# EAGLE design Random Bit Module (EAGLE 6.3)
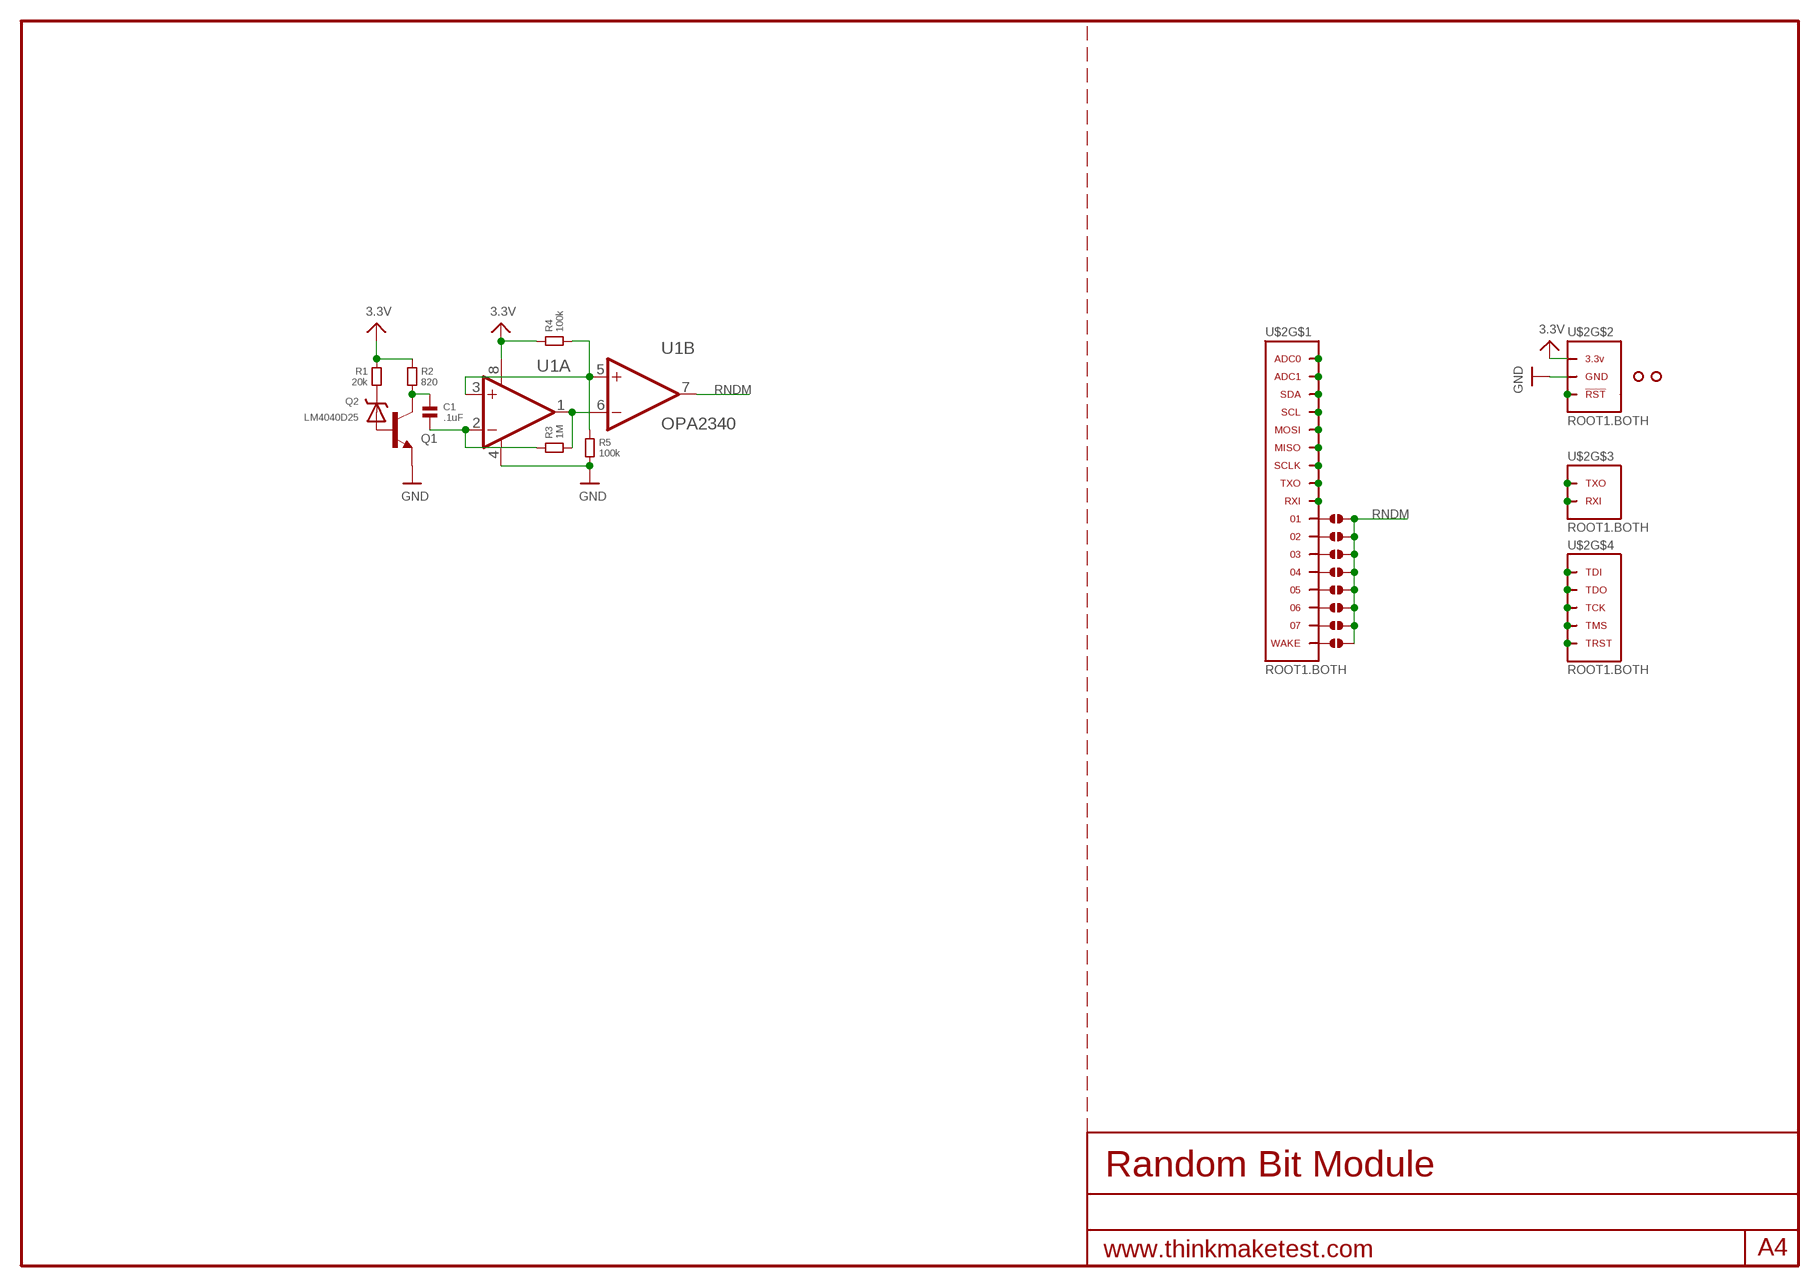
[diagram p0: schematic, sheet 1]

## Parts
C1  .1uF  CAPACITOR.0603  [0603]
J1  SOLDERJUMPER.2.SML  [2.SML]
J2  SOLDERJUMPER.2.SML  [2.SML]
J3  SOLDERJUMPER.2.SML  [2.SML]
J4  SOLDERJUMPER.2.SML  [2.SML]
J5  SOLDERJUMPER.2.SML  [2.SML]
J6  SOLDERJUMPER.2.SML  [2.SML]
J7  SOLDERJUMPER.2.SML  [2.SML]
J8  SOLDERJUMPER.2.SML  [2.SML]
Q1  TRANSISTOR_NPN  [SOT23-R]
Q2  LM4040D25  V-REFERENCESMD  [SOT23-3]
R1  20k  RESISTOR.0603  [0603]
R2  820  RESISTOR.0603  [0603]
R3  1M  RESISTOR.0603  [0603]
R4  100k  RESISTOR.0603  [0603]
R5  100k  RESISTOR.0603  [0603]
U1  OPA2340  OPA2340E  [MSOP08]
U$2  ROOT1.BOTH  [ROOT1.BOTH]
U$3  HOLE.2MM  [2MM]
U$4  HOLE.2MM  [2MM]

## Nets
3.3V: R1.1 R2.1 R4.1 U1.8(A:V+) U$2.3.3V@1(3.3V) U$2.3.3V@2(3.3V) U$2.3.3V@3(3.3V) U$2.3.3V@4(3.3V) U$2.3.3V@5(3.3V) U$2.3.3V@6(3.3V) U$2.3.3V@7(3.3V) U$2.3.3V@8(3.3V) U$2.3.3V@9(3.3V) U$2.3.3V@10(3.3V) U$2.3.3V@11(3.3V) U$2.3.3V@12(3.3V) U$2.3.3V@13(3.3V) U$2.3.3V@14(3.3V) U$2.3.3V@15(3.3V) U$2.3.3V@16(3.3V) U$2.3.3V@17(3.3V) U$2.3.3V@18(3.3V) U$2.3.3V@19(3.3V) U$2.3.3V@20(3.3V) U$2.3.3V@21(3.3V) U$2.3.3V@22(3.3V) U$2.3.3V@23(3.3V) U$2.3.3V@24(3.3V) U$2.3.3V@VIA(3.3V)
GND: Q1.2(E) R5.2 U1.4(A:V-) U$2.GND@1(GND) U$2.GND@2(GND) U$2.GND@3(GND) U$2.GND@4(GND) U$2.GND@5(GND) U$2.GND@6(GND) U$2.GND@7(GND) U$2.GND@8(GND) U$2.GND@9(GND) U$2.GND@10(GND) U$2.GND@11(GND) U$2.GND@12(GND) U$2.GND@13(GND) U$2.GND@14(GND) U$2.GND@15(GND) U$2.GND@16(GND) U$2.GND@17(GND) U$2.GND@18(GND) U$2.GND@19(GND) U$2.GND@20(GND) U$2.GND@21(GND) U$2.GND@22(GND) U$2.GND@23(GND) U$2.GND@24(GND) U$2.GND@25(GND) U$2.GND@26(GND) U$2.GND@VIA(GND)
N$1: J1.1 U$2.01 U$2.01@1 U$2.01@VIA
N$2: U$2.ADC1 U$2.ADC1@1(ADC1) U$2.ADC1@VIA(ADC1)
N$3: U$2.SDA U$2.SDA@1(SDA) U$2.SDA@VIA(SDA)
N$4: U$2.SCL U$2.SCL@1(SCL) U$2.SCL@VIA(SCL)
N$5: J2.1 U$2.02 U$2.02@1 U$2.02@VIA
N$6: U$2.MISO U$2.MISO@1(MISO) U$2.MISO@VIA(MISO)
N$7: U$2.SCLK U$2.SCLK@1(SCLK) U$2.SCLK@VIA(SCLK)
N$8: U$2.TXO U$2.TXO@1(TXO) U$2.TXO@VIA(TXO)
N$9: U$2.RXI U$2.RXI@1(RXI) U$2.RXI@VIA(RXI)
N$10: J3.1 U$2.03 U$2.03@1 U$2.03@VIA
N$11: J4.1 U$2.04 U$2.04@1 U$2.04@VIA
N$12: U$2.MOSI U$2.MOSI@1(MOSI) U$2.MOSI@VIA(MOSI)
N$13: U$2.ADC0 U$2.ADC0@1(ADC0) U$2.ADC0@VIA(ADC0)
N$14: J5.1 U$2.05 U$2.05@1 U$2.05@VIA
N$15: J6.1 U$2.06 U$2.06@1 U$2.06@VIA
N$16: J7.1 U$2.07 U$2.07@1 U$2.07@VIA
N$17: J8.1 U$2.WAKE U$2.WAKE@1(WAKE) U$2.WAKE@VIA(WAKE)
N$18: U$2.TDI U$2.TDI@1(TDI) U$2.TDI@VIA(TDI)
N$19: U$2.TDO U$2.TDO@1(TDO) U$2.TDO@VIA(TDO)
N$20: U$2.TCK U$2.TCK@1(TCK) U$2.TCK@VIA(TCK)
N$21: U$2.TMS U$2.TMS@1(TMS) U$2.TMS@VIA(TMS)
N$22: U$2.TRST U$2.TRST@1(TRST) U$2.TRST@VIA(TRST)
N$23: U$2.RXI.DBG(RXI) U$2.RXI.DBG@1(RXI) U$2.RXI.DBG@VIA(RXI)
N$24: U$2.TXO.DBG(TXO) U$2.TXO.DBG@1(TXO) U$2.TXO.DBG@VIA(TXO)
N$25: U$2.RST(!RST) U$2.RST@1(!RST) U$2.RST@VIA(!RST)
N$33: Q2.1(C) R1.2
N$34: C1.1 Q1.3(C) R2.2
N$35: Q1.1(B) Q2.2(A)
N$36: C1.2 R3.1 U1.2(A:-IN)
N$37: R4.2 R5.1 U1.3(A:+IN) U1.5(B:+IN)
N$39: R3.2 U1.1(A:OUT) U1.6(B:-IN)
RNDM: J1.2 J2.2 J3.2 J4.2 J5.2 J6.2 J7.2 J8.2 U1.7(B:OUT)

## Library data of the parts
C1 = .standardparts:CAPACITOR
J1-J8 = .solderjumper:SOLDERJUMPER.2
Q1 = microbuilder:TRANSISTOR_NPN: NPN Transistor Transistor (NPN) 500mA 45V - BC817 [Digikey: 568-1631-1-ND] Transistor (NPN) 500mA 45V - BC817,215 [Mouser: 771-BC817-T/R] SOT23-R - SOT23 footprint optimised for use with solder paste and reflow ovens. SOT23-W - SOT23 footprint optimised for hand-soldering (larger pads).
Q2 = SparkFun-DiscreteSemi:V-REFERENCE: Zener diode
R1-R5 = .standardparts:RESISTOR
U1 = burr-brown:OPA2340: Single-Supply, Rail-to-Rail Operational Amplifiers MicroAmplifier(TM) Series; Product Folder:OPA2340; MF: TEXAS INSTRUMENTS; MPN: OPA2340UA; OC_FARNELL: 1101541; OC_NEWARK: 36K7581
U$2 = thinkmaketest:ROOT1
U$3 U$4 = .screw_holes:HOLE

## Board
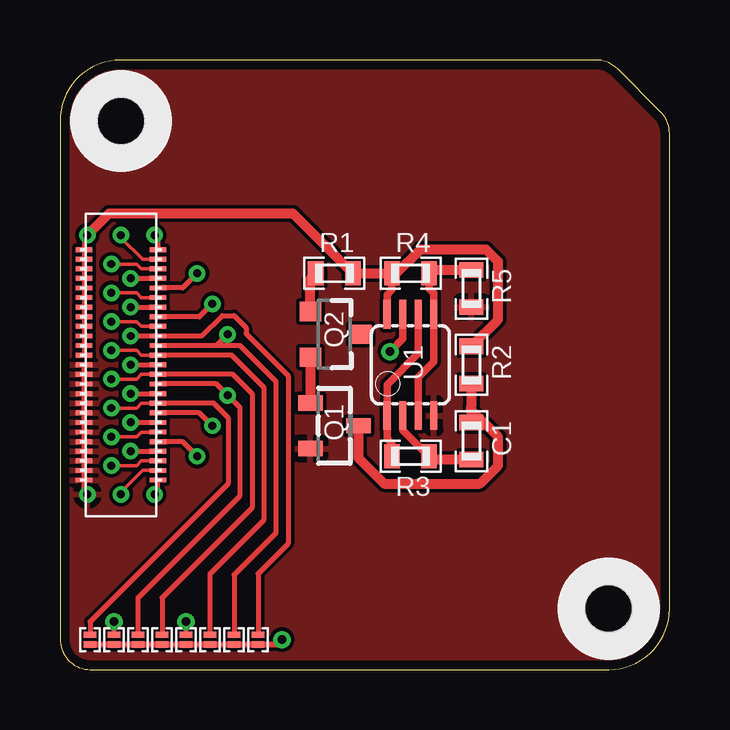
[diagram p1: board, top side]
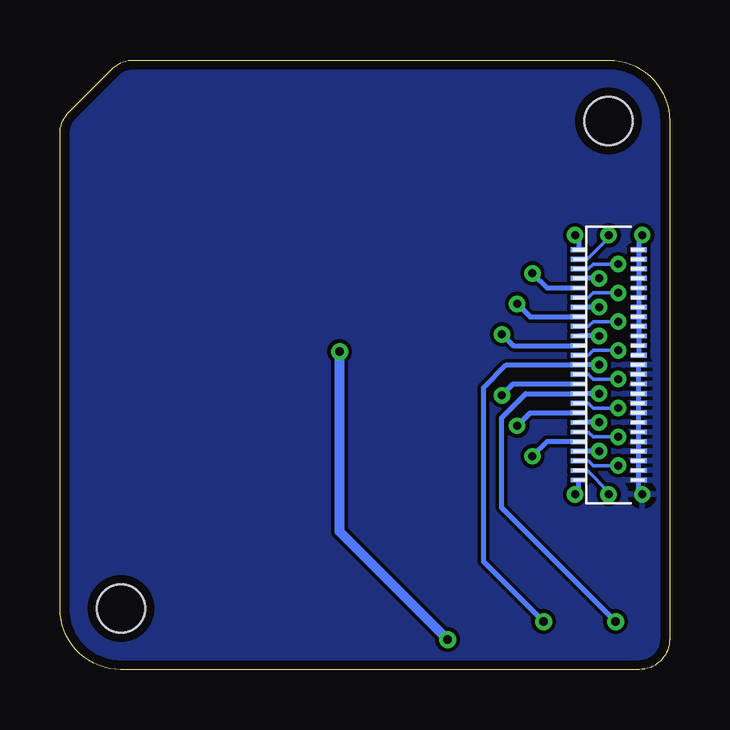
[diagram p2: board, bottom side, seen from below]

Size 25.4 x 25.4 mm. Coordinates in mm from the lower left corner, seen from the top.
Outline: 0,22.86 0,1.27 arc90 1.27,0 22.86,0 arc90 25.4,2.54 25.4,22.33 arc45 25.03,23.23 23.23,25.03 arc45 22.33,25.4 2.54,25.4 arc90 0,22.86
Copper layers (1*16): Top 0.0356mm / dielectric 1.5011mm / Bottom 0.0356mm
Design rules "default": minimum track width 6mil, minimum drill 13mil, track to track 6mil, track to pad 6mil, pad to pad 6mil, via to via 6mil, smd to smd 6mil, copper to edge 15mil, drill to drill 6mil, minimum pad ring 7mil, minimum via ring 7mil, stop-mask expansion 4mil, vias tented up to drill 16mil, thermal gap 10mil

### Footprints (pad centres in the part's own frame; a part is rotated, then mirrored left to right if it is on the bottom)
0603 = smd 0.65 x 1: 1 -0.775,0; 2 0.775,0
2.SML = smd 0.254 x 0.508: 1 -0.203,0; 2 0.203,0
SOT23-R = smd 0.635 x 1.016: 1 -0.95,-1; 2 0.95,-1; 3 0,1
SOT23-3 = smd 0.8 x 0.9: 1 -0.95,-1; 2 0.95,-1; 3 0,1.1
MSOP08 = smd 0.3 x 1.2: 1 -0.976,-2.113; 2 -0.326,-2.113; 3 0.324,-2.113; 4 0.974,-2.113; 5 0.974,2.112; 6 0.324,2.112; 7 -0.326,2.112; 8 -0.976,2.112
ROOT1.BOTH = smd 0.66 x 0.2 bottom: 01 3.795,13.9; 02 3.795,13.5; 03 3.795,13.1; 3.3V@1 1.285,17.5; 3.3V@2 1.285,17.1; 3.3V@3 1.285,16.7; 3.3V@4 1.285,16.3; 3.3V@5 1.285,15.9; 3.3V@6 1.285,15.5; 3.3V@7 1.285,15.1; 3.3V@8 1.285,14.7; 3.3V@9 1.285,14.3; 3.3V@10 1.285,13.9; 3.3V@11 1.285,13.5; 3.3V@12 1.285,13.1; 04 3.795,12.7; 05 3.795,12.3; 06 3.795,11.9; 07 3.795,11.5; ADC0 3.795,17.5; ADC1 3.795,17.1; GND@1 1.285,7.9; GND@2 1.285,8.3; GND@3 1.285,8.7; GND@4 1.285,9.1; GND@5 1.285,9.5; GND@6 1.285,9.9; GND@7 1.285,10.3; GND@8 1.285,10.7; GND@9 1.285,11.1; GND@10 1.285,11.5; GND@11 1.285,11.9; GND@12 1.285,12.3; GND@13 1.285,12.7; MISO 3.795,15.5; MOSI 3.795,15.9; RST 3.795,7.9; RXI 3.795,14.3; RXI.DBG 3.795,10.3; SCL 3.795,16.3; SCLK 3.795,15.1; SDA 3.795,16.7; TCK 3.795,9.1; TDI 3.795,9.9; TDO 3.795,9.5; TMS 3.795,8.7; TRST 3.795,8.3; TXO 3.795,14.7; TXO.DBG 3.795,10.7; WAKE 3.795,11.1 | smd 0.7 x 0.2: 01@1 4.08,13.9; 02@1 4.08,13.5; 3.3V@13 1,17.5; 3.3V@14 1,17.1; 3.3V@15 1,16.7; 3.3V@16 1,16.3; 3.3V@17 1,15.9; 3.3V@18 1,15.5; 3.3V@19 1,15.1; 3.3V@20 1,14.7; 3.3V@21 1,14.3; 3.3V@22 1,13.9; 3.3V@23 1,13.5; 3.3V@24 1,13.1; 03@1 4.08,13.1; 04@1 4.08,12.7; 05@1 4.08,12.3; 06@1 4.08,11.9; 07@1 4.08,11.5; ADC0@1 4.08,17.5; ADC1@1 4.08,17.1; GND@14 1,7.9; GND@15 1,8.3; GND@16 1,8.7; GND@17 1,9.1; GND@18 1,9.5; GND@19 1,9.9; GND@20 1,10.3; GND@21 1,10.7; GND@22 1,11.1; GND@23 1,11.5; GND@24 1,11.9; GND@25 1,12.3; GND@26 1,12.7; MISO@1 4.08,15.5; MOSI@1 4.08,15.9; RST@1 4.08,7.9; RXI.DBG@1 4.08,10.3; RXI@1 4.08,14.3; SCL@1 4.08,16.3; SCLK@1 4.08,15.1; SDA@1 4.08,16.7; TCK@1 4.08,9.1; TDI@1 4.08,9.9; TDO@1 4.08,9.5; TMS@1 4.08,8.7; TRST@1 4.08,8.3; TXO.DBG@1 4.08,10.7; TXO@1 4.08,14.7; WAKE@1 4.08,11.1 | drill 0.33 pad 0.686: 01@VIA 2.94,13.9; 02@VIA 6.985,13.97; 3.3V@VIA 1.14,18.1; 03@VIA 2.14,13.3; 04@VIA 2.94,12.7; 05@VIA 2.14,12.1; 06@VIA 6.985,11.43; 07@VIA 2.94,11.5; ADC0@VIA 3.94,18.1; ADC1@VIA 2.54,18.1; GND@VIA 1.14,7.3; MISO@VIA 2.14,15.7; MOSI@VIA 5.715,16.51; RST@VIA 3.94,7.3; RXI.DBG@VIA 2.94,10.3; RXI@VIA 2.14,14.5; SCL@VIA 2.94,16.3; SCLK@VIA 2.94,15.1; SDA@VIA 2.14,16.9; TCK@VIA 2.94,9.1; TDI@VIA 2.14,9.7; TDO@VIA 5.715,8.89; TMS@VIA 2.14,8.5; TRST@VIA 2.54,7.3; TXO.DBG@VIA 6.35,10.16; TXO@VIA 6.35,15.24; WAKE@VIA 2.14,10.9
2MM = hole 2: 0,0

### Placement (x,y rotation side)
C1  17.14,9.53 270 top
J1  8.25,1.25 270 top
J2  7.25,1.25 270 top
J3  6.25,1.25 270 top
J4  5.25,1.25 270 top
J5  4.25,1.25 270 top
J6  3.25,1.25 270 top
J7  2.25,1.25 270 top
J8  1.25,1.25 270 top
Q1  11.43,10.16 270 top
Q2  11.43,13.97 270 top
R1  11.43,16.51 180 top
R2  17.14,12.7 270 top
R3  14.61,8.89 180 top
R4  14.61,16.51 0 top
R5  17.14,15.88 270 top
U1  14.61,12.7 0 top
U$2  0,0 0 top
U$3  22.86,2.54 90 top
U$4  2.54,22.86 90 top

### Tracks (layer width: path | path; a pad name or v marks a point on that pad's centre or on a via)
3.3V
  Top 0.305: U1.8 13.63,15.63 13.83,15.83 R4.1
  Top 0.406: R2.1 18.25,14.58 18.25,17 17.75,17.5 15,17.5 14.01,16.51 R4.1 R1.1 9.71,19 2.04,19 U$2.3.3V@VIA
GND
  pour Bottom (rank 6): 0,0 25.4,0 25.4,25.4 0,25.4
  pour Top (rank 6): 0,0 25.4,0 25.4,25.4 0,25.4
N$1
  Top 0.203: U$2.01@1 5.9,13.9 6.75,14.75 7.25,14.75 7.75,14.25 7.75,14 9.5,12.25 9.5,5.25 8.25,4 J1.1
N$5
  Top 0.203: 6.51,13.5 7.5,13.5 9,12 9,5.7 7.25,3.95 J2.1
N$10
  Top 0.203: J3.1 6.25,4 8.5,6.25 8.5,11.75 7.15,13.1 U$2.03@1
N$11  (via drill 0.36)
  Top 0.203: J4.1 v5.25,2
  Bottom 0.203: v5.25,2 7.75,4.5 7.75,11.75 6.8,12.7 U$2.04
N$14
  Top 0.203: U$2.05@1 7.2,12.3 8,11.5 8,6.75 4.25,3 J5.1
N$15
  Top 0.203: J6.1 3.25,3 7.5,7.25 7.5,10.91 U$2.06@VIA
N$16  (via drill 0.36)
  Top 0.203: J7.1 v2.25,2
  Bottom 0.203: v2.25,2 7,6.75 7,10.5 6,11.5 U$2.07
N$17
  Top 0.203: U$2.WAKE@1 6.4,11.1 7,10.5 7,7.75 1.25,2 J8.1
N$33
  Top 0.406: Q2.1 10.43,16.29 R1.2
N$34
  Top 0.406: R2.2 17.14,11 17.14,10.8 | 17.14,10.8 C1.1 | Q1.3 12.43,8.82 13.5,7.75 17.5,7.75 18.25,8.5 18.25,9.7 17.14,10.8
N$35
  Top 0.406: Q2.2 Q1.1
N$36
  Top 0.305: U1.2 14.28,9.97 15.36,8.89 R3.1
  Top 0.406: C1.2 15.52,8.75 R3.1
N$37
  Top 0.305: U1.3 14.93,12.18 15.58,12.83 U1.5 15.58,15.67 15.38,15.87 R4.2
  Top 0.406: R5.1 15.52,16.65 R4.2
N$39
  Top 0.305: U1.6 14.93,13.18 13.63,11.88 U1.1 13.63,9.62 13.83,9.42 R3.2
RNDM  (via drill 0.36)
  Top 0.254: J8.2 J7.2 J6.2 J5.2 J4.2 J3.2 J2.2 J1.2 9.05,1.05 v9.25,1.25
  Top 0.305: v13.75,13.25 14.28,13.78 U1.7
  Bottom 0.406: v9.25,1.25 13.75,5.75 v13.75,13.25

### Text on the board
tDocu: RNDM
bDocu: Cruz Monrreal II | v1 | AnomalousMaker.com